# EAGLE schematic mixer (EAGLE 7.1.0)
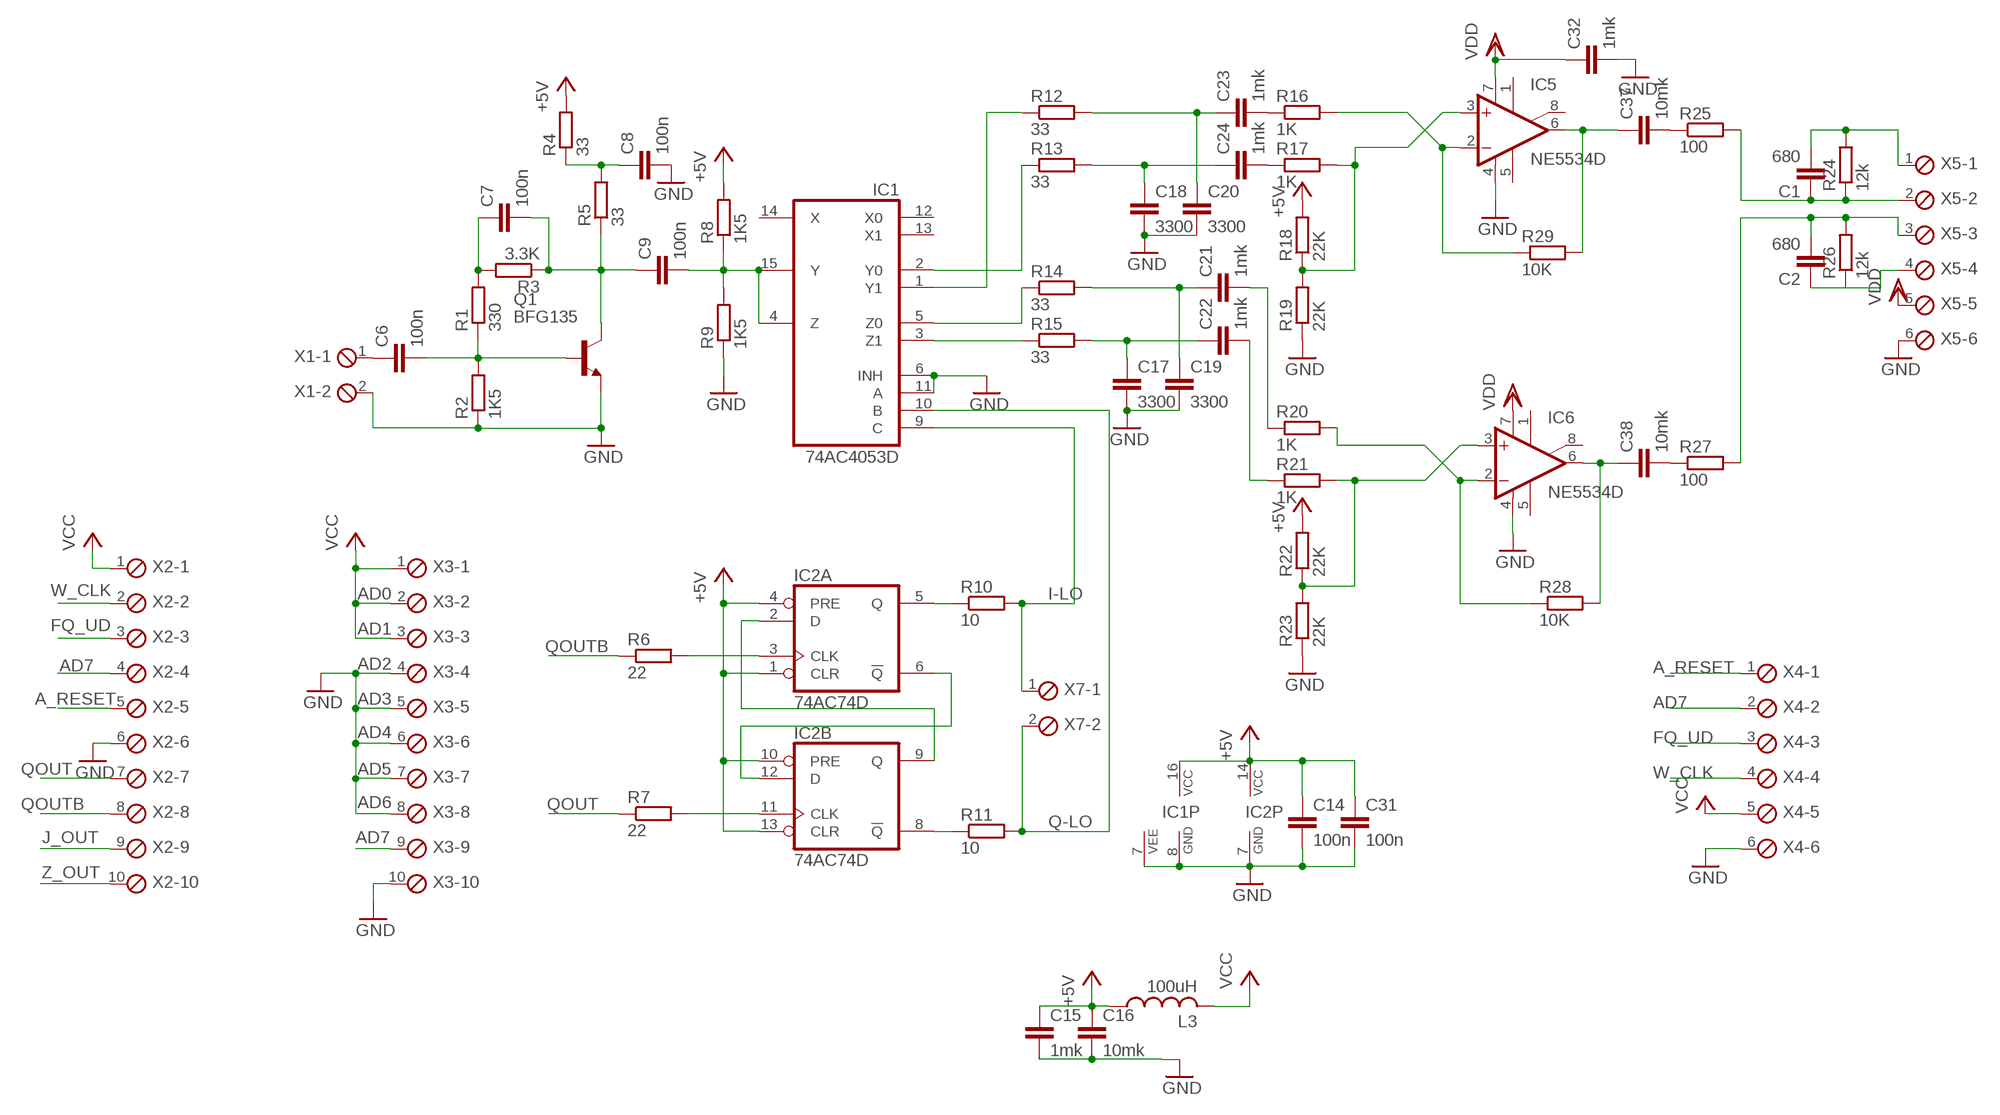
[diagram p0: schematic, sheet 1]

## Parts
C1  680  C-EUC0805  [C0805]
C2  680  C-EUC0805  [C0805]
C6  100n  C-EUC0603  [C0603]
C7  100n  C-EUC0603  [C0603]
C8  100n  C-EUC0603  [C0603]
C9  100n  C-EUC0603  [C0603]
C14  100n  C-EUC0603  [C0603]
C15  1mk  C-EUC0603  [C0603]
C16  10mk  C-EUC0805  [C0805]
C17  3300  C-EUC0805  [C0805]
C18  3300  C-EUC0805  [C0805]
C19  3300  C-EUC0805  [C0805]
C20  3300  C-EUC0805  [C0805]
C21  1mk  C-EUC0603  [C0603]
C22  1mk  C-EUC0603  [C0603]
C23  1mk  C-EUC0603  [C0603]
C24  1mk  C-EUC0603  [C0603]
C31  100n  C-EUC0603  [C0603]
C32  1mk  C-EUC0603  [C0603]
C37  10mk  C-EUC0805  [C0805]
C38  10mk  C-EUC0805  [C0805]
IC1  74AC4053D  4053D  [SO16]
IC2  74AC74D  [SO14]
IC5  NE5534D  [SO08]
IC6  NE5534D  [SO08]
L3  100uH  L-US0207/12  [0207/12]
Q1  BFG135  [SOT223]
R1  330  R-EU_R0603  [R0603]
R2  1K5  R-EU_R0603  [R0603]
R3  3.3K  R-EU_R0603  [R0603]
R4  33  R-EU_R0603  [R0603]
R5  33  R-EU_R0603  [R0603]
R6  22  R-EU_R0603  [R0603]
R7  22  R-EU_R0603  [R0603]
R8  1K5  R-EU_R0603  [R0603]
R9  1K5  R-EU_R0603  [R0603]
R10  10  R-EU_R0603  [R0603]
R11  10  R-EU_R0603  [R0603]
R12  33  R-EU_R0603  [R0603]
R13  33  R-EU_R0603  [R0603]
R14  33  R-EU_R0603  [R0603]
R15  33  R-EU_R0603  [R0603]
R16  1K  R-EU_R0603  [R0603]
R17  1K  R-EU_R0603  [R0603]
R18  22K  R-EU_R0603  [R0603]
R19  22K  R-EU_R0603  [R0603]
R20  1K  R-EU_R0603  [R0603]
R21  1K  R-EU_R0603  [R0603]
R22  22K  R-EU_R0603  [R0603]
R23  22K  R-EU_R0603  [R0603]
R24  12k  R-EU_R0603  [R0603]
R25  100  R-EU_R0603  [R0603]
R26  12k  R-EU_R0603  [R0603]
R27  100  R-EU_R0603  [R0603]
R28  10K  R-EU_R0603  [R0603]
R29  10K  R-EU_R0603  [R0603]
X1  MPT2  [2POL254]
X2  MPT10  [10POL254]
X3  MPT10  [10POL254]
X4  MPT6  [6POL254]
X5  MPT6  [6POL254]
X7  MPT2  [2POL254]

## Nets
+5V: C14.1 C15.1 C16.1 C31.1 IC1.16(VCC) IC2.1(A:CLR) IC2.4(A:PRE) IC2.10(B:PRE) IC2.13(B:CLR) IC2.14(P:VCC) L3.1 R4.2 R8.2 R18.2 R22.2
A_RESET: X2.5 X4.1
AD7: X2.4 X4.2
FQ_UD: X2.3 X4.3
GND: C8.2 C14.2 C15.2 C16.2 C17.2 C18.2 C19.2 C20.2 C31.2 C32.2 IC1.6(INH) IC1.7(VEE) IC1.8(GND) IC1.11(A) IC2.7(P:GND) IC5.4(V-) IC6.4(V-) Q1.1(E) Q1.3(E) R2.1 R9.1 R19.1 R23.1 X1.2 X2.6 X3.4 X3.5 X3.6 X3.7 X3.8 X3.10 X4.6 X5.6
I-LO: IC1.9(C) R10.2 X7.1
J_OUT: X2.9
N$1: IC2.2(A:D) IC2.9(B:Q)
N$2: IC2.6(A:!Q) IC2.12(B:D)
N$3: IC2.5(A:Q) R10.1
N$4: IC2.8(B:!Q) R11.1
N$5: IC1.3(Z1) R15.1
N$6: C9.2 IC1.4(Z) IC1.15(Y) R8.1 R9.2
N$7: C7.1 R1.2 R3.2
N$8: IC1.5(Z0) R14.1
N$9: IC1.2(Y0) R13.1
N$10: IC1.1(Y1) R12.1
N$11: C17.1 C22.1 R15.2
N$12: C19.1 C21.1 R14.2
N$13: C18.1 C24.1 R13.2
N$14: C20.1 C23.1 R12.2
N$15: IC5.3(+IN) R17.2 R18.1 R19.2
N$16: C38.1 IC6.6(OUT) R28.2
N$17: IC5.2(-IN) R16.2 R29.1
N$18: C37.1 IC5.6(OUT) R29.2
N$19: C23.2 R16.1
N$20: C21.2 R20.1
N$21: C22.2 R21.1
N$22: IC6.2(-IN) R20.2 R28.1
N$23: IC6.3(+IN) R21.2 R22.1 R23.2
N$24: C6.1 X1.1
N$25: C24.2 R17.1
N$26: C37.2 R25.1
N$27: C1.1 R24.1 R25.2 X5.2
N$28: C1.2 R24.2 X5.1
N$29: C2.1 R26.1 X5.4
N$30: C2.2 R26.2 R27.2 X5.3
N$31: IC2.3(A:CLK) R6.2
N$32: IC2.11(B:CLK) R7.2
N$33: C38.2 R27.1
N$34: C7.2 C9.1 Q1.4(C) R3.1 R5.1
N$36: X3.9
N$37: C8.1 R4.1 R5.2
N$44: C6.2 Q1.2(B) R1.1 R2.2
Q-LO: IC1.10(B) R11.2 X7.2
QOUT: R7.1 X2.7
QOUTB: R6.1 X2.8
VCC: L3.2 X2.1 X3.1 X3.2 X3.3 X4.5
VDD: C32.1 IC5.7(V+) IC6.7(V+) X5.5
W_CLK: X2.2 X4.4
Z_OUT: X2.10
Unconnected: IC1.12(X0) IC1.13(X1) IC1.14(X) IC5.1(ON) IC5.5(CMP) IC5.8(ON/CMP) IC6.1(ON) IC6.5(CMP) IC6.8(ON/CMP)

## Notes on the sheet
- AD0
- AD1
- AD2
- AD3
- AD4
- AD5
- AD6
- AD7

## Library data of the parts
C1 C2 C6-C9 C14-C24 C31 C32 C37 C38 = rcl:C-EU: CAPACITOR, European symbol
IC1 = 40xx:4053: Triple 2-channel ANALOG MULTIPLEXER
IC2 = 74xx-eu:74*74: Dual D type positive edge triggered FLIP FLOP, preset and clear
IC5 IC6 = linear:NE5534: LOW-NOISE OPERATIONAL AMPLIFIER Source: http://focus.ti.com/lit/ds/symlink/ne5534.pdf
L3 = rcl:L-US: INDUCTOR, American symbol
Q1 = balmer:BFG135: 7 GHz tranzistor
R1-R29 = rcl:R-EU_: RESISTOR, European symbol
X1 X7 = con-phoenix-254:MPT2: PHOENIX CONNECTOR; OC_FARNELL: unknown; OC_NEWARK: unknown
X2 X3 = con-phoenix-254:MPT10: PHOENIX CONNECTOR; OC_FARNELL: unknown; OC_NEWARK: unknown
X4 X5 = con-phoenix-254:MPT6: PHOENIX CONNECTOR; OC_FARNELL: unknown; OC_NEWARK: unknown